# Altium schematic sheet Sheet2.SchDoc
size A4
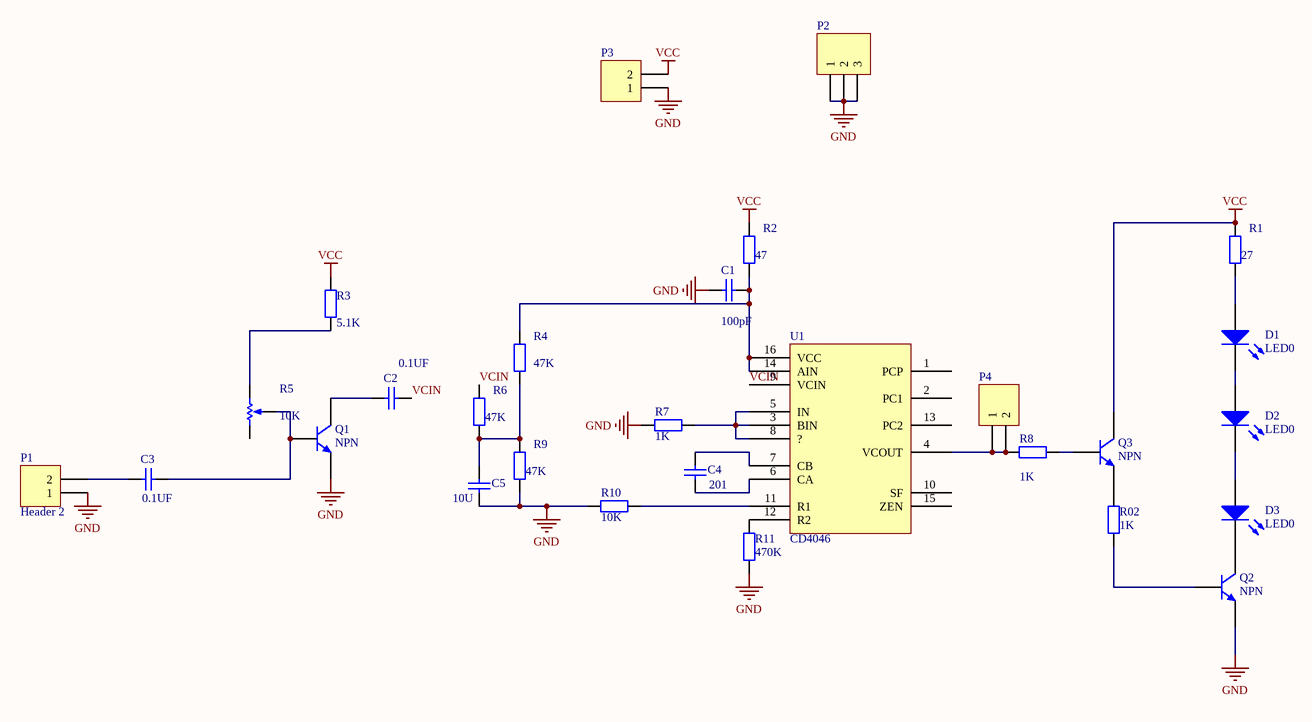
[diagram p0: Sheet2.SchDoc]

## Parts
C1  value 100pF  [CAPPR5-5x5]  (hidden comment: Cap)
C2  value 0.1UF  [6-0805]  (hidden comment: Cap)
C3  value 0.1UF  [6-0805]  (hidden comment: Cap)
C4  value 201  [6-0805]  (hidden comment: Cap)
C5  value 10U  [CAPPR5-5x5]  (hidden comment: Cap)
D1  LED0  [LED-0]
D2  LED0  [LED-0]
D3  LED0  [LED-0]
P1  Header 2  [HDR1X2]
P2  (no value)  [HDR1X3]
P3  (no value)  [HDR1X2]
P4  (no value)  [HDR1X2]
Q1  NPN  [TO-92]
Q2  NPN  [TO-92A]
Q3  NPN  [TO-92A]
R1  value 27  [6-0805]  (hidden comment: Res2)
R2  value 47  [6-0805]  (hidden comment: Res2)
R02  value 1K  [6-0805]  (hidden comment: Res2)
R3  value 5.1K  [AXIAL-0.3]  (hidden comment: Res2)
R4  value 47K  [6-0805]  (hidden comment: Res2)
R5  value 10K  [HDR1X3]
R6  value 47K  [6-0805]  (hidden comment: Res2)
R7  value 1K  [AXIAL-0.4]  (hidden comment: Res2)
R8  value 1K  [6-0805]  (hidden comment: Res2)
R9  value 47K  [6-0805]  (hidden comment: Res2)
R10  value 10K  [AXIAL-0.3]  (hidden comment: Res2)
R11  value 470K  [AXIAL-0.3]  (hidden comment: Res2)
U1  CD4046  [DIP-16]

## Nets
GND: C1.1 C5.1 P1.1 P2.1 P2.2 P2.3 P3.1 Q1.3(E) Q2.3(E) R7.2 R9.1 R10.2 R11.2
VCC: P3.2 Q3.1(C) R1.2 R2.2 R3.2
VCIN: C2.2 R6.2 U1.9(VCIN)
NetC1_2: C1.2 R2.1 R4.2 U1.14(AIN) U1.16(VCC)
NetC2_1: C2.1 Q1.1(C)
NetC3_1: C3.1 P1.2
NetC3_2: C3.2 Q1.2(B) R5.3(TAP)
NetC4_1: C4.1 U1.6(CA)
NetC4_2: C4.2 U1.7(CB)
NetC5_2: C5.2 R4.1 R6.1 R9.2
NetD1_1: D1.1(A) R1.1
NetD1_2: D1.2(K) D2.1(A)
NetD2_2: D2.2(K) D3.1(A)
NetD3_2: D3.2(K) Q2.1(C)
NetP4_1: P4.1 P4.2 R8.1 U1.4(VCOUT)
NetQ2_2: Q2.2(B) R02.1
NetQ3_2: Q3.2(B) R8.2
NetQ3_3: Q3.3(E) R02.2
NetR3_1: R3.1 R5.2(BOT)
NetR7_1: R7.1 U1.3(BIN) U1.5(IN) U1.8(?)
NetR10_1: R10.1 U1.11(R1)
NetR11_1: R11.1 U1.12(R2)

Not connected (* = marked no-connect by the designer): R5 1(TOP); U1 1(PCP) 2(PC1) 10(SF) 13(PC2) 15(ZEN)

## Library data of the parts
C1-C5 = Cap: Capacitor; Published: 8-Jun-2000; LatestRevisionDate: 17-Jul-2002; LatestRevisionNote: Re-released for DXP Platform.; PackageReference: RAD-0.3; Publisher: Altium Limited
D1-D3 = LED0: Typical INFRARED GaAs LED; Published: 8-Jun-2000; LatestRevisionDate: 08-Jul-2005; LatestRevisionNote: Mech Layer 1 removed.; PackageReference: LED-0; Publisher: Altium Limited
P1 P3 P4 = Header 2: Header, 2-Pin; LatestRevisionDate: 17-Jul-2002; LatestRevisionNote: Re-released for DXP Platform.; Publisher: Altium Limited
P2 = Header 3: Header, 3-Pin; LatestRevisionDate: 17-Jul-2002; LatestRevisionNote: Re-released for DXP Platform.; Publisher: Altium Limited
Q1-Q3 = NPN: NPN Bipolar Transistor; Published: 8-Jun-2000; LatestRevisionDate: 17-Jul-2002; LatestRevisionNote: Re-released for DXP Platform.; PackageReference: TO-226; Publisher: Altium Limited; Code_JEDEC: TO-226-AA
R1 R2 R02-R4 R6-R11 = Res2: Resistor; Published: 8-Jun-2000; LatestRevisionDate: 17-Jul-2002; LatestRevisionNote: Re-released for DXP Platform.; PackageReference: AXIAL-0.4; Publisher: Altium Limited
R5 = RPot: Potentiometer; Sim Note: Enter the Resistance value and the set point into parameter fields.; Set Position: 0.5; Published: 8-Jun-2000; LatestRevisionDate: 17-Jul-2002; LatestRevisionNote: Re-released for DXP Platform.; PackageReference: VR5; Publisher: Altium Limited
U1 = Component_1